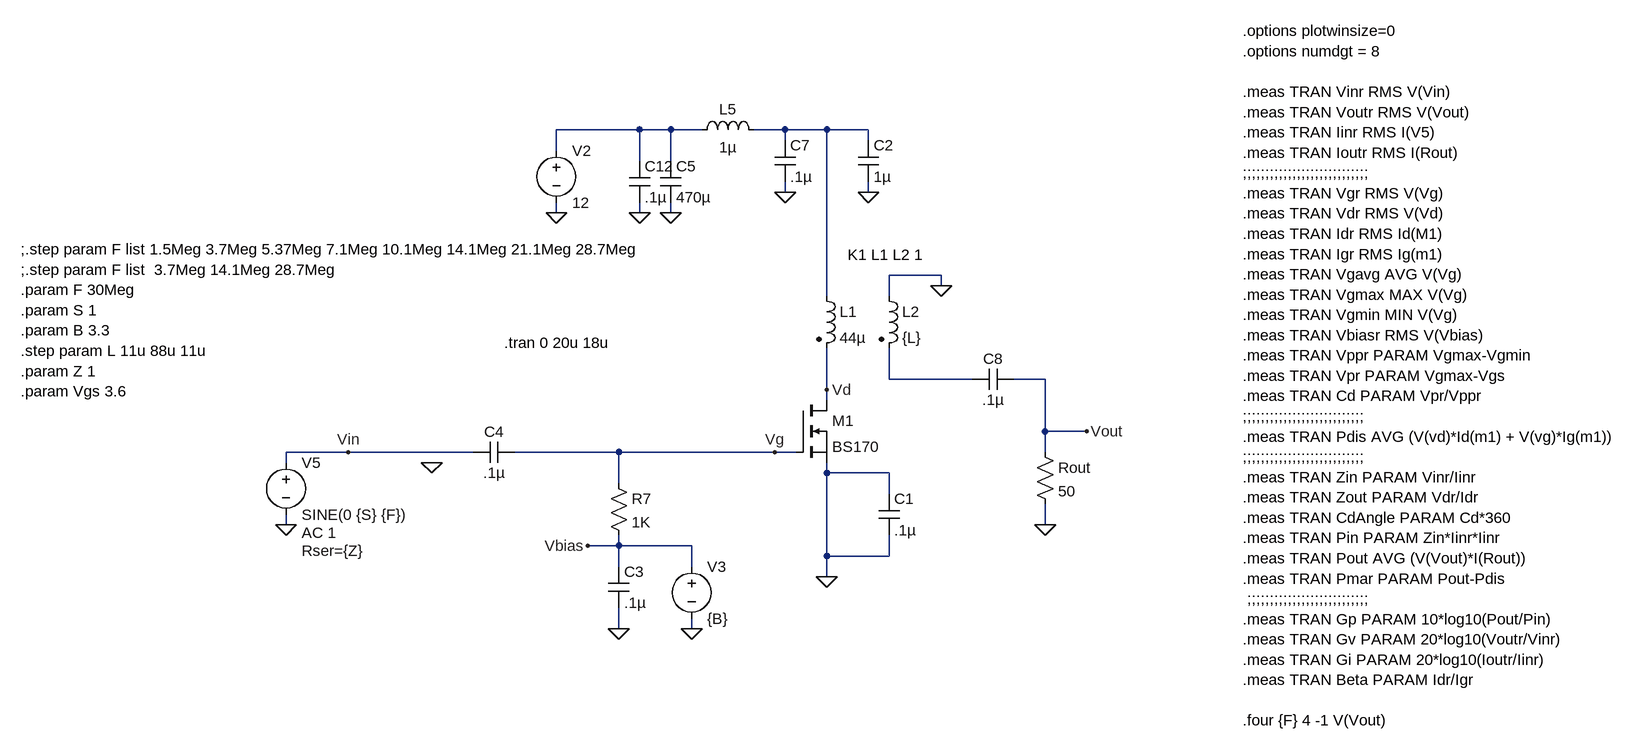
[diagram p0: schematic BS170 Testing Power Amp.asc]
BS170 Testing Power Amp.asc, the LTspice schematic file:
Version 4
SHEET 1 3060 1616
WIRE 1056 -400 928 -400
WIRE 1104 -400 1056 -400
WIRE 1152 -400 1104 -400
WIRE 1280 -400 1232 -400
WIRE 1344 -400 1280 -400
WIRE 1408 -400 1344 -400
WIRE 1280 -384 1280 -400
WIRE 1408 -384 1408 -400
WIRE 928 -368 928 -400
WIRE 1056 -352 1056 -400
WIRE 1104 -352 1104 -400
WIRE 1280 -304 1280 -320
WIRE 1408 -304 1408 -320
WIRE 928 -272 928 -288
WIRE 1056 -272 1056 -288
WIRE 1104 -272 1104 -288
WIRE 1520 -176 1440 -176
WIRE 1520 -160 1520 -176
WIRE 1344 -144 1344 -400
WIRE 1440 -144 1440 -176
WIRE 1440 -16 1440 -64
WIRE 1568 -16 1440 -16
WIRE 1680 -16 1632 -16
WIRE 1344 0 1344 -64
WIRE 1344 16 1344 0
WIRE 1680 64 1680 -16
WIRE 1744 64 1680 64
WIRE 608 96 512 96
WIRE 800 96 608 96
WIRE 1024 96 864 96
WIRE 1264 96 1024 96
WIRE 1296 96 1264 96
WIRE 1680 96 1680 64
WIRE 512 112 512 96
WIRE 1344 128 1344 112
WIRE 1440 128 1344 128
WIRE 1024 144 1024 96
WIRE 1440 160 1440 128
WIRE 512 208 512 192
WIRE 1680 208 1680 176
WIRE 1024 240 1024 224
WIRE 1024 240 976 240
WIRE 1136 240 1024 240
WIRE 1344 256 1344 128
WIRE 1440 256 1440 224
WIRE 1440 256 1344 256
WIRE 1024 272 1024 240
WIRE 1136 272 1136 240
WIRE 1344 288 1344 256
WIRE 1024 368 1024 336
WIRE 1136 368 1136 352
FLAG 928 -272 0
FLAG 1136 368 0
FLAG 1344 288 0
FLAG 1104 -272 0
FLAG 1280 -304 0
FLAG 1408 -304 0
FLAG 1056 -272 0
FLAG 1680 208 0
FLAG 1744 64 Vout
FLAG 1264 96 Vg
FLAG 1344 0 Vd
FLAG 512 208 0
FLAG 1024 368 0
FLAG 608 96 Vin
FLAG 976 240 Vbias
FLAG 736 112 0
FLAG 1520 -160 0
SYMBOL voltage 928 -384 R0
WINDOW 123 0 0 Left 2
WINDOW 39 0 0 Left 2
SYMATTR InstName V2
SYMATTR Value 12
SYMBOL cap 864 80 R90
WINDOW 0 0 32 VBottom 2
WINDOW 3 32 32 VTop 2
SYMATTR InstName C4
SYMATTR Value .1µ
SYMBOL voltage 1136 256 R0
WINDOW 123 0 0 Left 2
WINDOW 39 0 0 Left 2
SYMATTR InstName V3
SYMATTR Value {B}
SYMBOL res 1008 128 R0
SYMATTR InstName R7
SYMATTR Value 1K
SYMBOL ind 1136 -384 R270
WINDOW 0 32 56 VTop 2
WINDOW 3 5 56 VBottom 2
SYMATTR InstName L5
SYMATTR Value 1µ
SYMBOL cap 1088 -352 R0
SYMATTR InstName C5
SYMATTR Value 470µ
SYMBOL cap 1264 -384 R0
SYMATTR InstName C7
SYMATTR Value .1µ
SYMBOL cap 1568 0 R270
WINDOW 0 32 32 VTop 2
WINDOW 3 0 32 VBottom 2
SYMATTR InstName C8
SYMATTR Value .1µ
SYMBOL cap 1392 -384 R0
SYMATTR InstName C2
SYMATTR Value 1µ
SYMBOL cap 1040 -352 R0
SYMATTR InstName C12
SYMATTR Value .1µ
SYMBOL res 1664 80 R0
SYMATTR InstName Rout
SYMATTR Value 50
SYMBOL voltage 512 96 R0
WINDOW 123 24 124 Left 2
WINDOW 39 24 152 Left 2
SYMATTR Value2 AC 1
SYMATTR SpiceLine Rser={Z}
SYMATTR InstName V5
SYMATTR Value SINE(0 {S} {F})
SYMBOL nmos 1296 16 R0
SYMATTR InstName M1
SYMATTR Value BS170
SYMBOL cap 1008 272 R0
SYMATTR InstName C3
SYMATTR Value .1µ
SYMBOL cap 1424 160 R0
SYMATTR InstName C1
SYMATTR Value .1µ
SYMBOL ind2 1328 -160 R0
SYMATTR InstName L1
SYMATTR Value 44µ
SYMATTR Type ind
SYMBOL ind2 1424 -160 R0
SYMATTR InstName L2
SYMATTR Value {L}
SYMATTR Type ind
TEXT 848 -72 Left 2 !.tran 0 20u 18u
TEXT 1984 -552 Left 2 !.options plotwinsize=0\n.options numdgt = 8\n \n.meas TRAN Vinr RMS V(Vin)\n.meas TRAN Voutr RMS V(Vout)\n.meas TRAN Iinr RMS I(V5)\n.meas TRAN Ioutr RMS I(Rout)\n;;;;;;;;;;;;;;;;;;;;;;;;;;;;\n.meas TRAN Vgr RMS V(Vg)\n.meas TRAN Vdr RMS V(Vd)\n.meas TRAN Idr RMS Id(M1)\n.meas TRAN Igr RMS Ig(m1)\n.meas TRAN Vgavg AVG V(Vg)\n.meas TRAN Vgmax MAX V(Vg)\n.meas TRAN Vgmin MIN V(Vg)\n.meas TRAN Vbiasr RMS V(Vbias)\n.meas TRAN Vppr PARAM Vgmax-Vgmin\n.meas TRAN Vpr PARAM Vgmax-Vgs\n.meas TRAN Cd PARAM Vpr/Vppr\n;;;;;;;;;;;;;;;;;;;;;;;;;;;\n.meas TRAN Pdis AVG (V(vd)*Id(m1) + V(vg)*Ig(m1))\n;;;;;;;;;;;;;;;;;;;;;;;;;;;\n.meas TRAN Zin PARAM Vinr/Iinr\n.meas TRAN Zout PARAM Vdr/Idr\n.meas TRAN CdAngle PARAM Cd*360\n.meas TRAN Pin PARAM Zin*Iinr*Iinr\n.meas TRAN Pout AVG (V(Vout)*I(Rout))\n.meas TRAN Pmar PARAM Pout-Pdis\n ;;;;;;;;;;;;;;;;;;;;;;;;;;;\n.meas TRAN Gp PARAM 10*log10(Pout/Pin)\n.meas TRAN Gv PARAM 20*log10(Voutr/Vinr)\n.meas TRAN Gi PARAM 20*log10(Ioutr/Iinr)\n.meas TRAN Beta PARAM Idr/Igr\n \n.four {F} 4 -1 V(Vout)
TEXT 104 -216 Left 2 !;.step param F list 1.5Meg 3.7Meg 5.37Meg 7.1Meg 10.1Meg 14.1Meg 21.1Meg 28.7Meg\n;.step param F list  3.7Meg 14.1Meg 28.7Meg\n.param F 30Meg\n.param S 1\n.param B 3.3\n.step param L 11u 88u 11u\n.param Z 1\n.param Vgs 3.6
TEXT 1376 -208 Left 2 !K1 L1 L2 1

The netlist it stands for:
* BS170 Testing Power Amp.asc
V2 N001 0 12
C4 Vg Vin .1µ
V3 Vbias 0 {B}
R7 Vg Vbias 1K
L5 N001 N002 1µ
C5 N001 0 470µ
C7 N002 0 .1µ
C8 N003 Vout .1µ
C2 N002 0 1µ
C12 N001 0 .1µ
Rout Vout 0 50
V5 Vin 0 SINE(0 {S} {F}) AC 1 Rser={Z}
M1 Vd Vg 0 0 BS170
C3 Vbias 0 .1µ
C1 0 0 .1µ
L1 N002 Vd 44µ
L2 0 N003 {L}
.model NMOS NMOS
.model PMOS PMOS
.lib standard.mos
.tran 0 20u 18u
.options plotwinsize=0
.options numdgt = 8
.meas TRAN Vinr RMS V(Vin)
.meas TRAN Voutr RMS V(Vout)
.meas TRAN Iinr RMS I(V5)
.meas TRAN Ioutr RMS I(Rout)
;;;;;;;;;;;;;;;;;;;;;;;;;;;;
.meas TRAN Vgr RMS V(Vg)
.meas TRAN Vdr RMS V(Vd)
.meas TRAN Idr RMS Id(M1)
.meas TRAN Igr RMS Ig(m1)
.meas TRAN Vgavg AVG V(Vg)
.meas TRAN Vgmax MAX V(Vg)
.meas TRAN Vgmin MIN V(Vg)
.meas TRAN Vbiasr RMS V(Vbias)
.meas TRAN Vppr PARAM Vgmax-Vgmin
.meas TRAN Vpr PARAM Vgmax-Vgs
.meas TRAN Cd PARAM Vpr/Vppr
;;;;;;;;;;;;;;;;;;;;;;;;;;;
.meas TRAN Pdis AVG (V(vd)*Id(m1) + V(vg)*Ig(m1))
;;;;;;;;;;;;;;;;;;;;;;;;;;;
.meas TRAN Zin PARAM Vinr/Iinr
.meas TRAN Zout PARAM Vdr/Idr
.meas TRAN CdAngle PARAM Cd*360
.meas TRAN Pin PARAM Zin*Iinr*Iinr
.meas TRAN Pout AVG (V(Vout)*I(Rout))
.meas TRAN Pmar PARAM Pout-Pdis
 ;;;;;;;;;;;;;;;;;;;;;;;;;;;
.meas TRAN Gp PARAM 10*log10(Pout/Pin)
.meas TRAN Gv PARAM 20*log10(Voutr/Vinr)
.meas TRAN Gi PARAM 20*log10(Ioutr/Iinr)
.meas TRAN Beta PARAM Idr/Igr
.four {F} 4 -1 V(Vout)
;.step param F list 1.5Meg 3.7Meg 5.37Meg 7.1Meg 10.1Meg 14.1Meg 21.1Meg 28.7Meg
;.step param F list  3.7Meg 14.1Meg 28.7Meg
.param F 30Meg
.param S 1
.param B 3.3
.step param L 11u 88u 11u
.param Z 1
.param Vgs 3.6
K1 L1 L2 1
.backanno
.end